# Altium schematic sheet RLC测试仪.SCHDOC
size A3
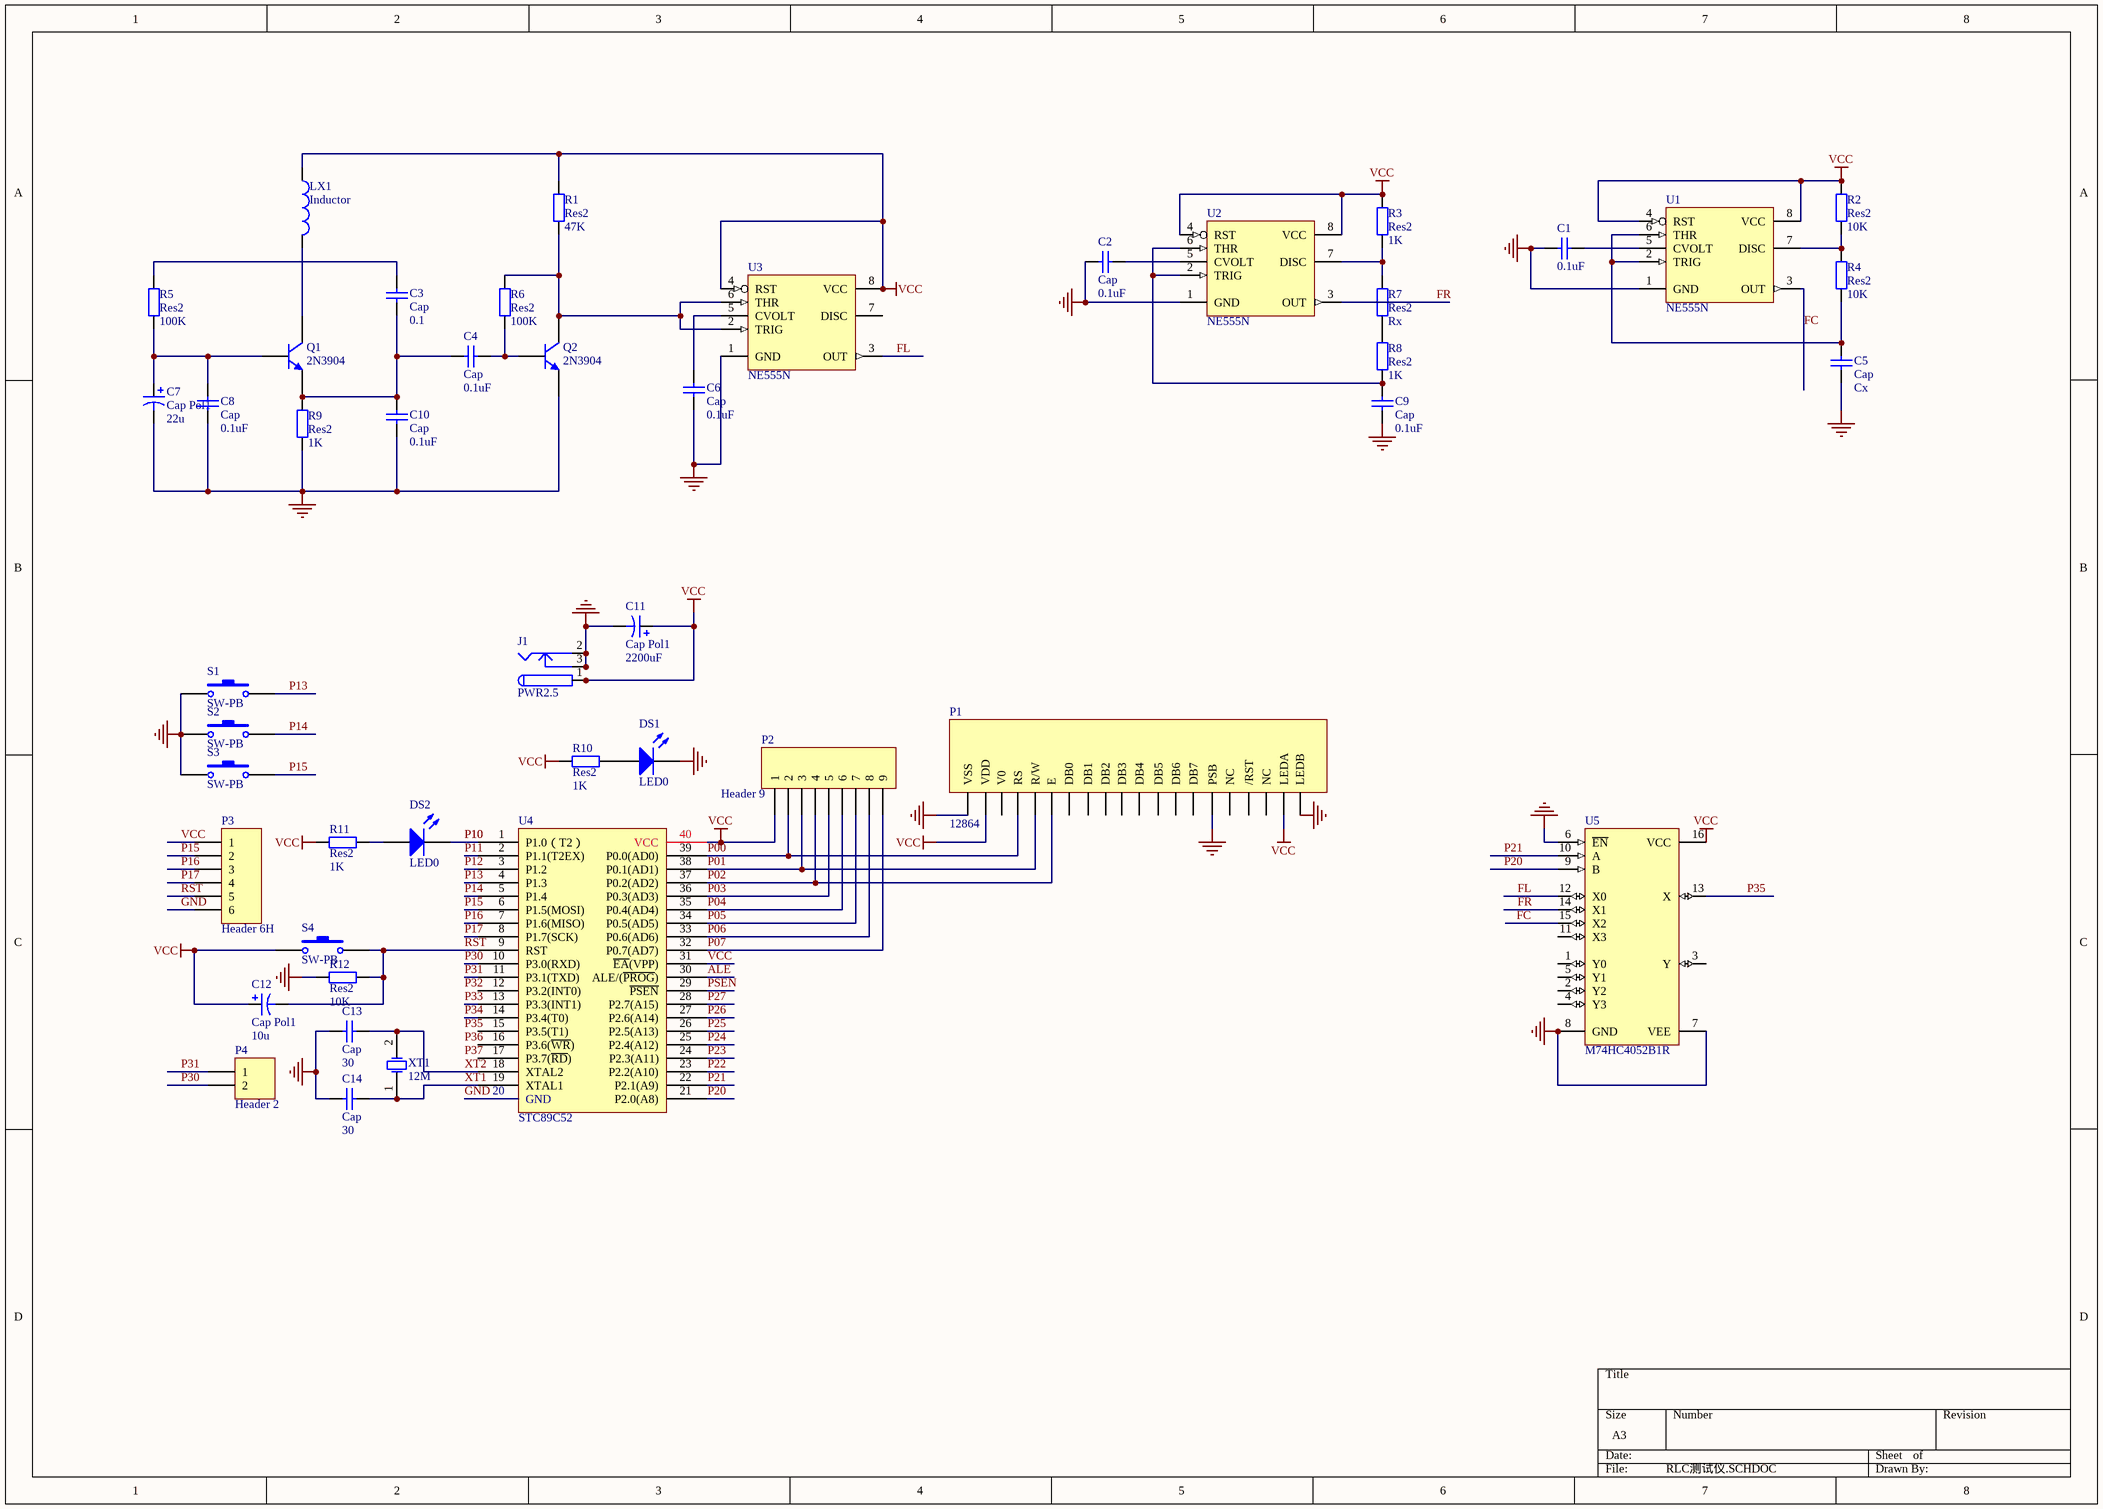
[diagram p0: RLC测试仪.SCHDOC]

## Parts
C1  0.1uF  [RAD-0.2]
C2  Cap  value 0.1uF  [RAD-0.2]
C3  Cap  value 0.1  [RAD-0.2]
C4  Cap  value 0.1uF  [RAD-0.2]
C5  Cap  value Cx  [RAD-0.2]
C6  Cap  value 0.1uF  [RAD-0.2]
C7  Cap Pol1  value 22u  [电容]
C8  Cap  value 0.1uF  [RAD-0.2]
C9  Cap  value 0.1uF  [RAD-0.2]
C10  Cap  value 0.1uF  [RAD-0.2]
C11  Cap Pol1  value 2200uF  [电容]
C12  Cap Pol1  value 10u  [电容]
C13  Cap  value 30  [RAD-0.1]
C14  Cap  value 30  [RAD-0.1]
DS1  LED0  [RAD-0.1]
DS2  LED0  [RAD-0.1]
J1  PWR2.5  [KLD-0202]
LX1  Inductor  [RAD-0.3]
P1  12864  [HDR1X20]
P2  Header 9  [HDR1X9]
P3  Header 6H  [HDR1X6]
P4  Header 2  [HDR1X2]
Q1  2N3904  [BCY-W3/E4]
Q2  2N3904  [BCY-W3/E4]
R1  Res2  value 47K  [AXIAL-0.4]
R2  Res2  value 10K  [AXIAL-0.4]
R3  Res2  value 1K  [AXIAL-0.4]
R4  Res2  value 10K  [AXIAL-0.4]
R5  Res2  value 100K  [AXIAL-0.4]
R6  Res2  value 100K  [AXIAL-0.4]
R7  Res2  value Rx  [AXIAL-0.4]
R8  Res2  value 1K  [AXIAL-0.4]
R9  Res2  value 1K  [AXIAL-0.4]
R10  Res2  value 1K  [AXIAL-0.4]
R11  Res2  value 1K  [AXIAL-0.4]
R12  Res2  value 10K  [AXIAL-0.4]
S1  SW-PB  [点动按键]
S2  SW-PB  [点动按键]
S3  SW-PB  [点动按键]
S4  SW-PB  [点动按键]
U1  NE555N  [DIP8]
U2  NE555N  [DIP8]
U3  NE555N  [DIP8]
U4  STC89C52  [AT89S52]
U5  M74HC4052B1R  [DIP16]
XT1  12M  [圆晶振]

## Nets
GND: C1.2 C2.2 C5.1 C6.2 C7.2 C8.1 C9.1 C10.1 C11.2 C13.1 C14.1 DS1.2(K) J1.2 J1.2A J1.2B J1.3 J1.3A J1.3B P1.1(VSS) P1.15(PSB) P1.20(LEDB) P3.6 Q2.1(E) R9.1 R12.1 S1.1 S2.1 S3.1 U1.1(GND) U2.1(GND) U3.1(GND) U4.20(GND) U5.6(~{EN}) U5.7(VEE) U5.8(GND)
VCC: C11.1 C12.1 J1.1 J1.1A J1.1B LX1.1 P1.2(VDD) P1.19(LEDA) P2.1 P3.1 R1.2 R2.2 R3.2 R10.1 R11.2 S4.1 U1.4(RST) U1.8(VCC) U2.4(RST) U2.8(VCC) U3.4(RST) U3.8(VCC) U4.31(~{EA}(VPP)) U4.40(VCC) U5.16(VCC)
ALE: U4.30(ALE/(~{PROG}))
FC: U1.3(OUT) U5.15(X2)
FL: U3.3(OUT) U5.12(X0)
FR: U2.3(OUT) U5.14(X1)
P00: P1.4(RS) P2.2 U4.39(P0.0(AD0))
P01: P1.5(R/W) P2.3 U4.38(P0.1(AD1))
P02: P1.6(E) P2.4 U4.37(P0.2(AD2))
P03: P2.5 U4.36(P0.3(AD3))
P04: P2.6 U4.35(P0.4(AD4))
P05: P2.7 U4.34(P0.5(AD5))
P06: P2.8 U4.33(P0.6(AD6))
P07: P2.9 U4.32(P0.7(AD7))
P10: DS2.2(K) U4.1(P1.0（T2）)
P11: U4.2(P1.1(T2EX))
P12: U4.3(P1.2)
P13: S1.2 U4.4(P1.3)
P14: S2.2 U4.5(P1.4)
P15: P3.2 S3.2 U4.6(P1.5(MOSI))
P16: P3.3 U4.7(P1.6(MISO))
P17: P3.4 U4.8(P1.7(SCK))
P20: U4.21(P2.0(A8)) U5.9(B)
P21: U4.22(P2.1(A9)) U5.10(A)
P22: U4.23(P2.2(A10))
P23: U4.24(P2.3(A11))
P24: U4.25(P2.4(A12))
P25: U4.26(P2.5(A13))
P26: U4.27(P2.6(A14))
P27: U4.28(P2.7(A15))
P30: P4.2 U4.10(P3.0(RXD))
P31: P4.1 U4.11(P3.1(TXD))
P33: U4.13(P3.3(INT1))
P34: U4.14(P3.4(T0))
P35: U5.13(X)
PSEN: U4.29(~{PSEN})
RST: C12.2 P3.5 R12.2 S4.2 U4.9(RST)
XT1: C14.2 U4.19(XTAL1) XT1.1(OSC1)
XT2: C13.2 U4.18(XTAL2) XT1.2(OSC2)
NetC1_1: C1.1 U1.5(CVOLT)
NetC2_1: C2.1 U2.5(CVOLT)
NetC3_1: C3.1 C4.2 C10.2 Q1.1(E) R9.2
NetC3_2: C3.2 R5.2
NetC4_1: C4.1 Q2.2(B) R6.2
NetC5_2: C5.2 R4.1 U1.2(TRIG) U1.6(THR)
NetC6_1: C6.1 U3.5(CVOLT)
NetC7_1: C7.1 C8.2 Q1.2(B) R5.1
NetC9_2: C9.2 R8.2 U2.2(TRIG) U2.6(THR)
NetDS1_1: DS1.1(A) R10.2
NetDS2_1: DS2.1(A) R11.1
NetLX1_2: LX1.2 Q1.3(C)
NetQ2_3: Q2.3(C) R1.1 R6.1 U3.2(TRIG) U3.6(THR)
NetR2_1: R2.1 R4.2 U1.7(DISC)
NetR3_1: R3.1 R7.2 U2.7(DISC)
NetR7_1: R7.1 R8.1

Not connected (* = marked no-connect by the designer): P1 3(V0) 7(DB0) 8(DB1) 9(DB2) 10(DB3) 11(DB4) 12(DB5) 13(DB6) 14(DB7) 16(NC) 17(/RST) 18(NC); U3 7(DISC); U4 12(P3.2(INT0)) 15(P3.5(T1)) 16(P3.6(~{WR})) 17(P3.7(~{RD})); U5 1(Y0) 2(Y2) 3(Y) 4(Y3) 5(Y1) 11(X3)

## Notes on the sheet
- Labels drawn without touching a wire or pin: P32, P35, P36, P37

## Library data of the parts
C1-C6 C8-C10 C13 C14 = Cap: Capacitor; Published: 8-Jun-2000; LatestRevisionDate: 17-Jul-2002; LatestRevisionNote: Re-released for DXP Platform.; Publisher: Altium Limited
C7 C11 C12 = Cap Pol1: Polarized Capacitor (Radial); Published: 8-Jun-2000; LatestRevisionDate: 17-Jul-2002; LatestRevisionNote: Re-released for DXP Platform.; Publisher: Altium Limited
DS1 DS2 = LED0: Typical INFRARED GaAs LED; Published: 8-Jun-2000; LatestRevisionDate: 17-Jul-2002; LatestRevisionNote: Re-released for DXP Platform.; Publisher: Altium Limited
J1 = PWR2.5: Low Voltage Power Supply Connector; Published: 17-Dec-2003; DatasheetDocument: 09-May-2002; Publisher: Altium Limited
LX1 = Inductor: Code_IEC: 1005; Published: 8-Jun-2000; LatestRevisionDate: 17-Jul-2002; LatestRevisionNote: Re-released for DXP Platform.; PackageReference: 0402-A; Publisher: Altium Limited; Code_JEITA: 0402
P2 = Header 9: Header, 9-Pin; LatestRevisionDate: 17-Jul-2002; LatestRevisionNote: Re-released for DXP Platform.; Publisher: Altium Limited
P3 = Header 6H: Header, 6-Pin, Right Angle; LatestRevisionDate: 17-Jul-2002; LatestRevisionNote: Re-released for DXP Platform.; Publisher: Altium Limited
P4 = Header 2: Header, 2-Pin; LatestRevisionDate: 17-Jul-2002; LatestRevisionNote: Re-released for DXP Platform.; Publisher: Altium Limited
Q1 Q2 = 2N3904: NPN General Purpose Amplifier; Published: 8-Jun-2000; LatestRevisionDate: 15-Jan-2003; LatestRevisionNote: PCB Footprint 'BCY-W3/D4.7' replaced; DatasheetDocument: 1997; PackageReference: TO-92A; Publisher: Altium Limited; Code_JEDEC: TO-92A
R1-R12 = Res2: Resistor; Published: 8-Jun-2000; LatestRevisionDate: 17-Jul-2002; LatestRevisionNote: Re-released for DXP Platform.; Publisher: Altium Limited
S1-S4 = SW-PB: Switch; Published: 24-Mar-1999; LatestRevisionDate: 17-Jul-2002; LatestRevisionNote: Re-released for DXP Platform.; Publisher: Altium Limited
U1-U3 = NE555N: General-Purpose Single Bipolar Timer; Published: 24-Aug-2001; LatestRevisionDate: 17-Jul-2002; LatestRevisionNote: Re-released for DXP Platform.; DatasheetDocument: Jul-1998; PackageReference: DIP8; Publisher: Altium Limited; Code_JEDEC: MO-001-AN
U4 = AT89S52
U5 = M74HC4052B1R: Analog Multiplexer/Demultiplexer Dual 4-Channel; Published: 8-Jun-2000; LatestRevisionDate: 17-Jul-2002; LatestRevisionNote: Re-released for DXP Platform.; DatasheetDocument: Oct-1993; PackageDocument: Apr-1996; PackageReference: DIP16; Publisher: Altium Limited
XT1 = XTAL2